# Altium project COMECA.PrjPcb
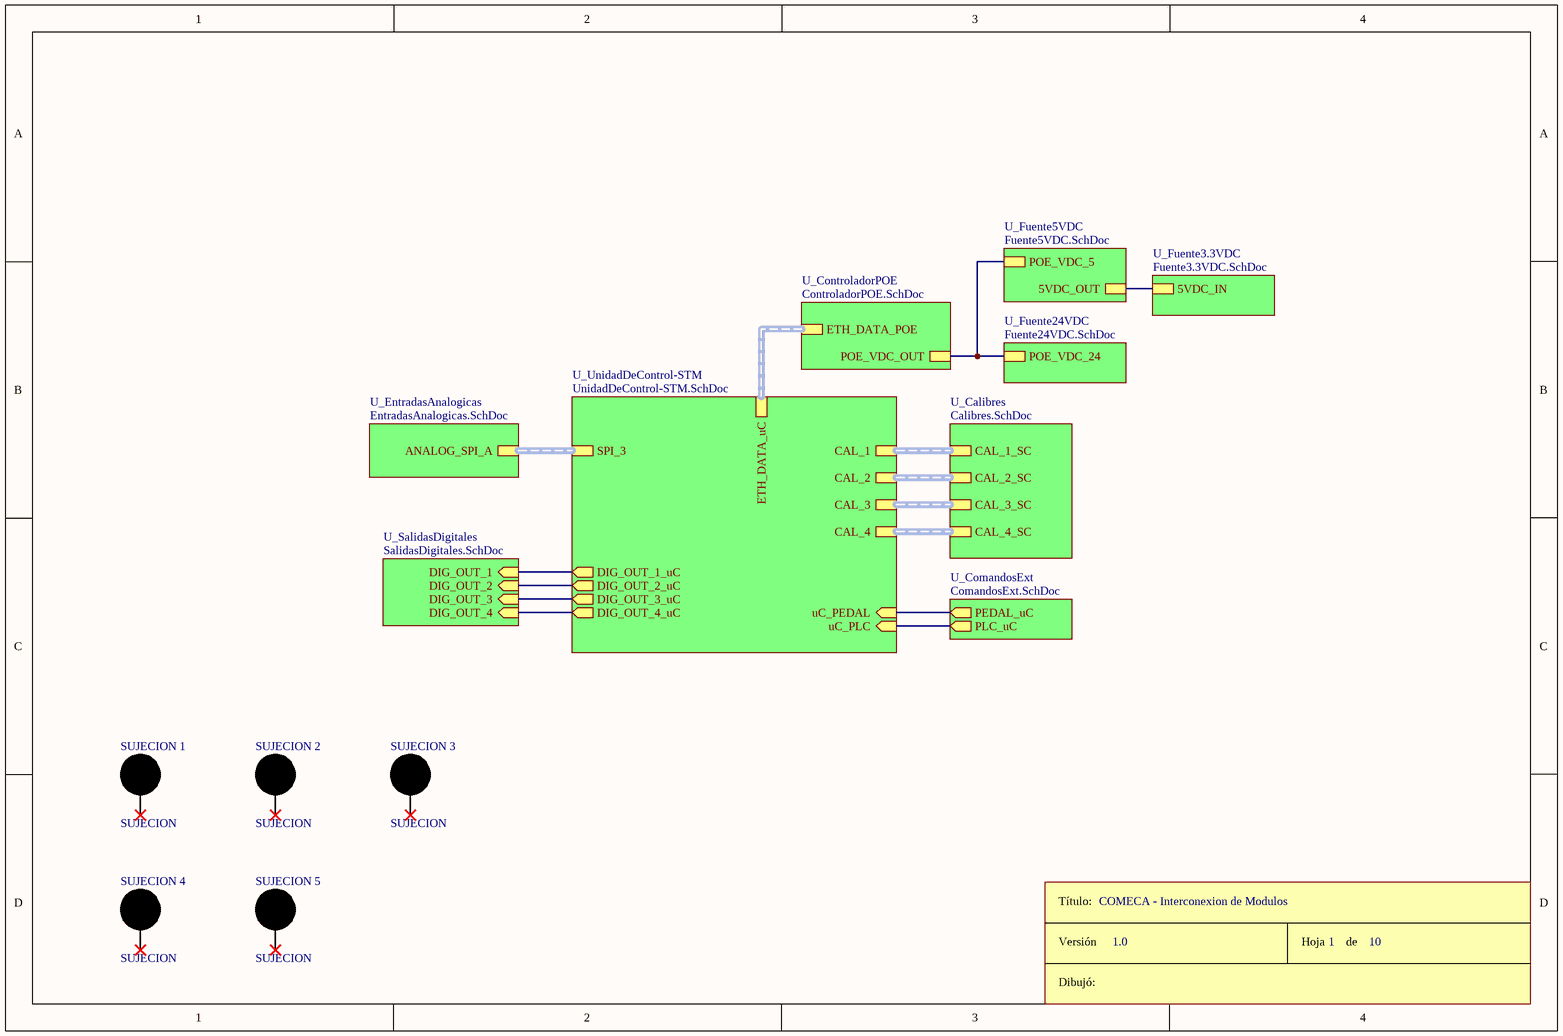
[diagram p0: COMECA_Main.SchDoc]
7 sheets, 101 parts. Net scope: hierarchical (ports join the sheet entries above them; power ports are global).
Board file: COMECA-PCBv1.PcbDoc
Sheets:
  COMECA_Main.SchDoc
    U_ControladorPOE = ControladorPOE.SchDoc
    U_Fuente5VDC = Fuente5VDC.SchDoc
    U_Fuente24VDC = Fuente24VDC.SchDoc
    U_Fuente3.3VDC = Fuente3.3VDC.SchDoc
    U_EntradasAnalogicas = EntradasAnalogicas.SchDoc
    U_SalidasDigitales = SalidasDigitales.SchDoc

## Sheet COMECA_Main.SchDoc
size A4; SheetNumber: 1; SheetTotal: 10

### Parts
ROT9  Rótulo  (value not drawn)  (graphical)
SUJECION_1  SUJECION  [SUJECION (5.00MM - 3.50MM)]
SUJECION_2  SUJECION  [SUJECION (5.00MM - 3.50MM)]
SUJECION_3  SUJECION  [SUJECION (5.00MM - 3.50MM)]
SUJECION_4  SUJECION  [SUJECION (5.00MM - 3.50MM)]
SUJECION_5  SUJECION  [SUJECION (5.00MM - 3.50MM)]

### Sub-sheets
U_Calibres = Calibres.SchDoc (file not in this document): CAL_4_SC (harness CALIBRE), CAL_3_SC (harness CALIBRE), CAL_2_SC (harness CALIBRE), CAL_1_SC (harness CALIBRE)
U_ComandosExt = ComandosExt.SchDoc (file not in this document): PLC_uC (out), PEDAL_uC (out)
U_ControladorPOE = ControladorPOE.SchDoc: POE_VDC_OUT, ETH_DATA_POE (harness ETH_DATA)
U_EntradasAnalogicas = EntradasAnalogicas.SchDoc: ANALOG_SPI_A (harness ANALOG_SPI)
U_Fuente3.3VDC = Fuente3.3VDC.SchDoc: 5VDC_IN
U_Fuente5VDC = Fuente5VDC.SchDoc: POE_VDC_5, 5VDC_OUT
U_Fuente24VDC = Fuente24VDC.SchDoc: POE_VDC_24
U_SalidasDigitales = SalidasDigitales.SchDoc: DIG_OUT_4 (in), DIG_OUT_2 (in), DIG_OUT_3 (in), DIG_OUT_1 (in)
U_UnidadDeControl-STM = UnidadDeControl-STM.SchDoc (file not in this document): uC_PLC (in), uC_PEDAL (in), SPI_3 (harness ANALOG_SPI), CAL_2 (harness CALIBRE), CAL_3 (harness CALIBRE), CAL_4 (harness CALIBRE), CAL_1 (harness CALIBRE), DIG_OUT_3_uC (out), DIG_OUT_2_uC (out), DIG_OUT_1_uC (out), DIG_OUT_4_uC (out), ETH_DATA_uC (harness ETH_DATA)

### Nets
5VDC_OUT: sheet U_Fuente5VDC/5VDC_OUT, sheet U_Fuente3.3VDC/5VDC_IN
VDD: sheet U_ControladorPOE/POE_VDC_OUT, sheet U_Fuente5VDC/POE_VDC_5, sheet U_Fuente24VDC/POE_VDC_24
NetR13_1: sheet U_UnidadDeControl-STM/DIG_OUT_1_uC, sheet U_SalidasDigitales/DIG_OUT_1
NetR16_1: sheet U_UnidadDeControl-STM/DIG_OUT_2_uC, sheet U_SalidasDigitales/DIG_OUT_2
NetR19_1: sheet U_UnidadDeControl-STM/DIG_OUT_3_uC, sheet U_SalidasDigitales/DIG_OUT_3
NetR22_1: sheet U_UnidadDeControl-STM/DIG_OUT_4_uC, sheet U_SalidasDigitales/DIG_OUT_4
(unnamed): sheet U_ComandosExt/PLC_uC, sheet U_UnidadDeControl-STM/uC_PLC
(unnamed): sheet U_ComandosExt/PEDAL_uC, sheet U_UnidadDeControl-STM/uC_PEDAL

Not connected (* = marked no-connect by the designer): SUJECION_1 1*; SUJECION_2 1*; SUJECION_3 1*; SUJECION_4 1*; SUJECION_5 1*

### Buses and harness runs
harness sheet U_Calibres/CAL_1_SC = sheet U_UnidadDeControl-STM/CAL_1
harness sheet U_Calibres/CAL_2_SC = sheet U_UnidadDeControl-STM/CAL_2
harness sheet U_Calibres/CAL_3_SC = sheet U_UnidadDeControl-STM/CAL_3
harness sheet U_Calibres/CAL_4_SC = sheet U_UnidadDeControl-STM/CAL_4
harness sheet U_ControladorPOE/ETH_DATA_POE = sheet U_UnidadDeControl-STM/ETH_DATA_uC
harness sheet U_EntradasAnalogicas/ANALOG_SPI_A = sheet U_UnidadDeControl-STM/SPI_3

### Notes on the sheet
- COMECA - Interconexion de Modulos
- 1.0
- 1
- 10
- (in symbol Rótulo) Título:; Versión; Hoja       de; Dibujó:

## Sheet ControladorPOE.SchDoc
size A4; SheetNumber: 8; SheetTotal: 10
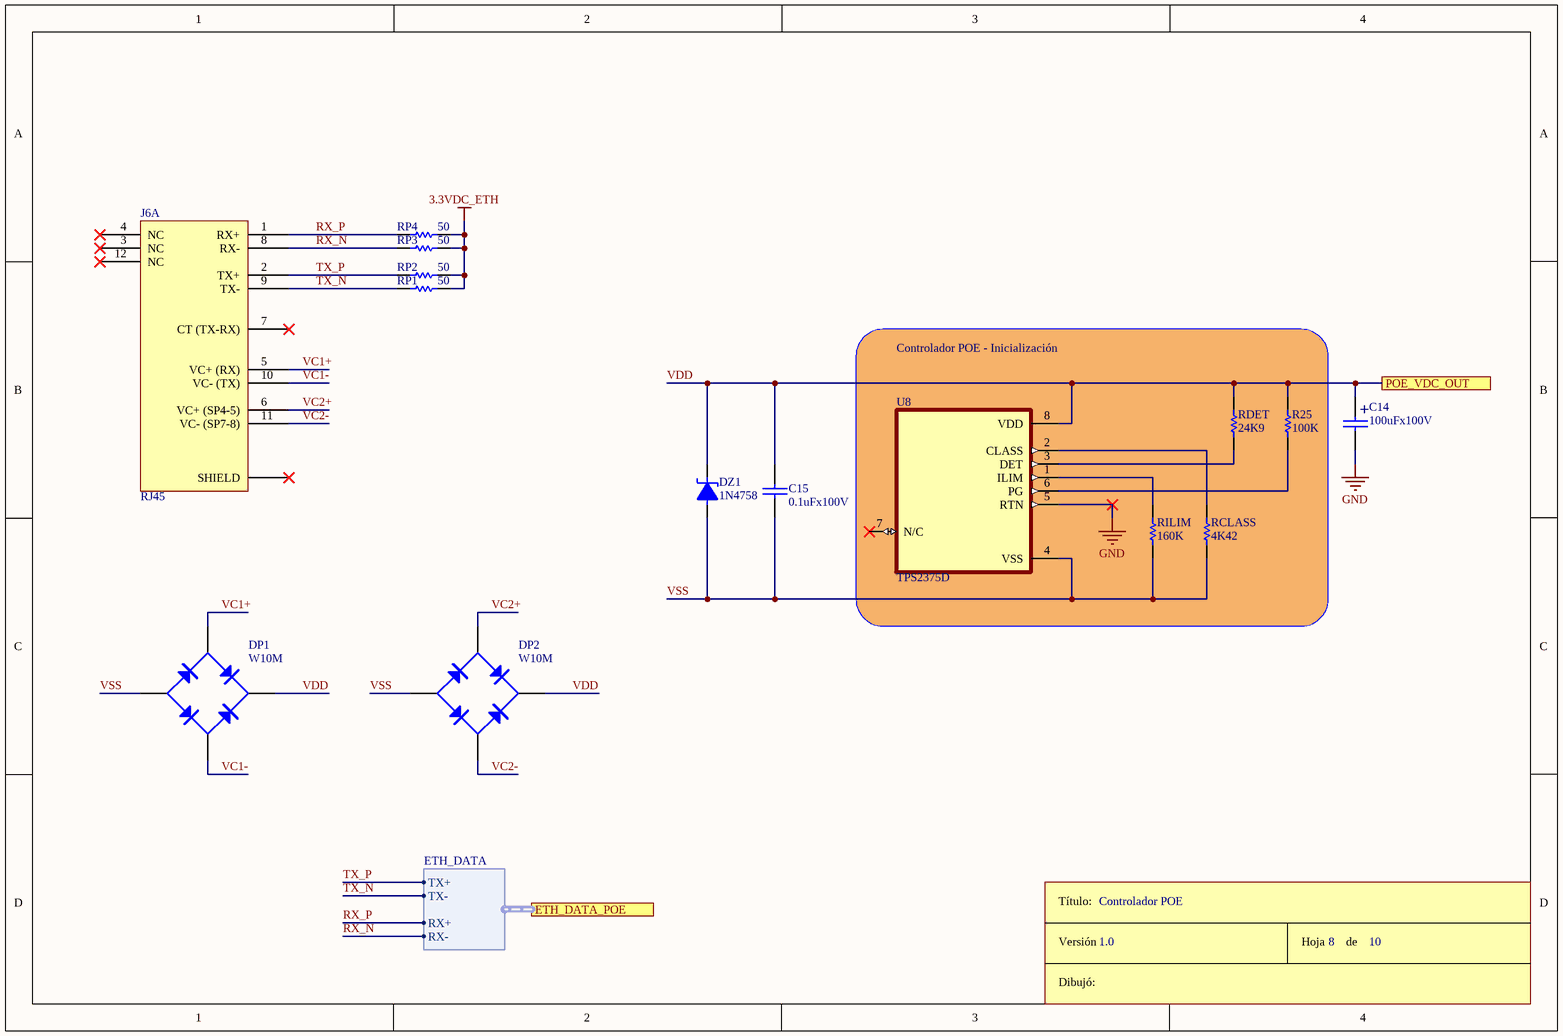
[diagram p1: ControladorPOE.SchDoc]

### Parts
C14  100uFx100V  [CAP200RP]
C15  0.1uFx100V  [CAP300]
DP1  W10M  [PUENTE - W10M]
DP2  W10M  [PUENTE - W10M]
DZ1  1N4758  [DO41]
J6A  RJ45  [ARJP11C-MB]
R25  100K  [RES300]
RCLASS  4K42  [RES300]
RDET  24K9  [RES300]
RILIM  160K  [RES300]
ROT7  Rótulo  (value not drawn)  (graphical)
RP1  50  [1206]
RP2  50  [1206]
RP3  50  [1206]
RP4  50  [1206]
U8  TPS2375D  [SOIC127P599X175-8N]

### Blocks framed on the sheet
Controlador POE - Inicialización: R25 RCLASS RDET RILIM U8

### Ports
ETH_DATA_POE (harness ETH_DATA), POE_VDC_OUT

### Harnesses
ETH_DATA: TX+, TX-, RX+, RX-

### Nets
3.3VDC_ETH: RP1.2 RP2.2 RP3.2 RP4.2
GND: C14.2 U8.5(RTN)  [project net ANALOG_GND_A]
RX_N: J6A.8(RX-) RP3.1 ; port ETH_DATA_POE.RX-
RX_P: J6A.1(RX+) RP4.1 ; port ETH_DATA_POE.RX+
TX_N: J6A.9(TX-) RP1.1 ; port ETH_DATA_POE.TX-
TX_P: J6A.2(TX+) RP2.1 ; port ETH_DATA_POE.TX+
VC1+: DP1.2(AC) J6A.5(VC+_(RX))
VC1-: DP1.4(AC) J6A.10(VC-_(TX))
VC2+: DP2.2(AC) J6A.6(VC+_(SP4-5))
VC2-: DP2.4(AC) J6A.11(VC-_(SP7-8))
VDD: C14.1 C15.1 DP1.1(V+) DP2.1(V+) DZ1.2 R25.2 RDET.2 U8.8(VDD) ; port POE_VDC_OUT
VSS: C15.2 DP1.3(V-) DP2.3(V-) DZ1.1 RCLASS.1 RILIM.1 U8.4(VSS)
NetR25_1: R25.1 U8.6(PG)
NetRCLASS_2: RCLASS.2 U8.2(CLASS)
NetRDET_1: RDET.1 U8.3(DET)
NetRILIM_2: RILIM.2 U8.1(ILIM)

Not connected (* = marked no-connect by the designer): J6A 3(NC)* 4(NC)* 7(CT_(TX-RX))* 12(NC)* SHIELD*; U8 7(N/C)*

### Notes on the sheet
- Controlador POE
- 1.0
- 8
- 10
- (in symbol CAPPOL) +
- (in symbol Rótulo) Título:; Versión; Hoja       de; Dibujó:

### Library data of the parts
C14 = CAPPOL
C15 = CAP
DP1 DP2 = W10M: Bridge Rectifier TH 1000V 1.5A
DZ1 = DIODO ZENER
J6A = ARJP11C-MBSC-L2: Magjack Connector for PoE
R25 RCLASS RDET RILIM RP1-RP4 = RES
U8 = TPS2375D: Class 3 PoE PD with latch protection 8-SOIC -40 to 85; MF: Texas Instruments; Purchase-URL: https://pricing.snapeda.com/search/part/TPS2375D/?ref=eda; MP: TPS2375D; Package: SOIC-8 Texas Instruments; SnapEDA_Link: https://www.snapeda.com/parts/TPS2375D/Texas%20Instruments/view-part/570877/?ref=snap; Value: *; Check_prices: https://www.snapeda.com/parts/TPS2375D/Texas%20Instruments/view-part/570877/?ref=eda; Digi-Key_Part_Number: 296-26922-2-ND

## Sheet Fuente5VDC.SchDoc
size A4; SheetNumber: 3; SheetTotal: 10
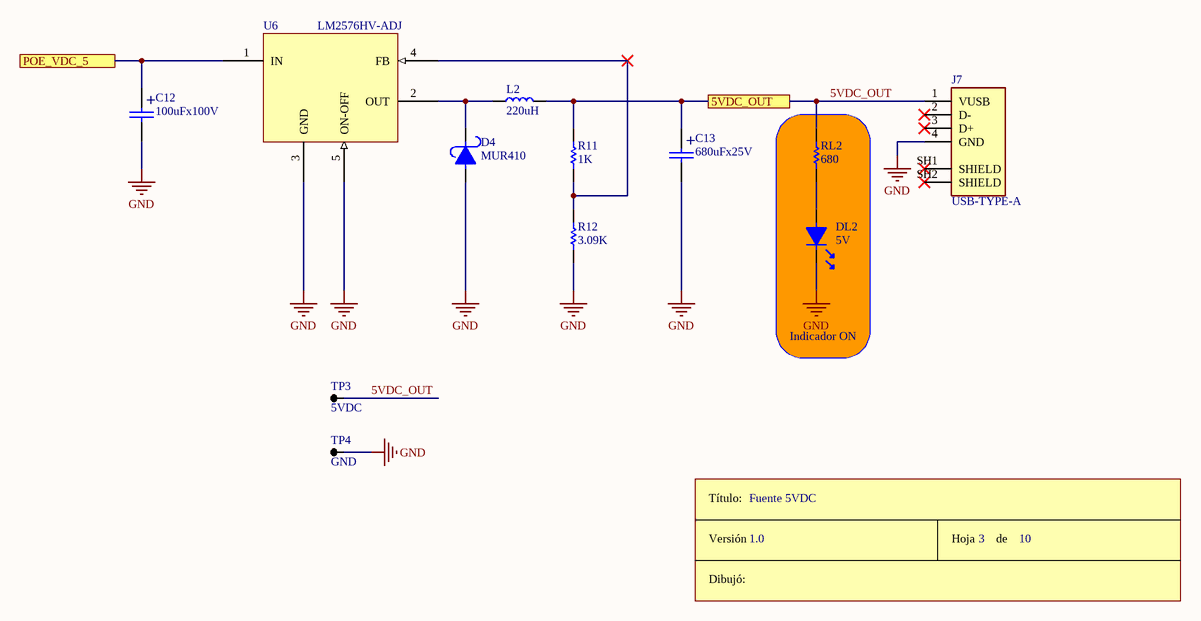
[diagram p2: Fuente5VDC.SchDoc]

### Parts
C12  100uFx100V  [CAP200RP]
C13  680uFx25V  [CAP200RP]
D4  MUR410  [DO41-EXT]
DL2  5V  [LED3]
J7  USB-TYPE-A  [TE_6364372-2]
L2  220uH  [CHOKE_PAD]
R11  1K  [RES300]
R12  3.09K  [RES300]
RL2  680  [RES300]
ROT5  Rótulo  (value not drawn)  (graphical)
TP3  5VDC  [TPTH]
TP4  GND  [TPTH]
U6  LM2576HV-ADJ  [TO220-5]

### Blocks framed on the sheet
Indicador ON: DL2 RL2

### Ports
5VDC_OUT, POE_VDC_5

### Nets
GND: C12.2 C13.2 D4.1 DL2.2 J7.4(GND) R12.1 TP4.1 U6.3(GND) U6.5(ON-OFF)  [project net ANALOG_GND_A]
5VDC_OUT: C13.1 J7.1(VUSB) L2.2 R11.2 RL2.2 TP3.1 ; port 5VDC_OUT
VDD: C12.1 U6.1(IN) ; port POE_VDC_5
NetD4_2: D4.2 L2.1 U6.2(OUT)
NetDL2_1: DL2.1 RL2.1
NetR11_1: R11.1 R12.2 U6.4(FB)

Not connected (* = marked no-connect by the designer): J7 2(D-)* 3(D+)* SH1(SHIELD)* SH2(SHIELD)*

### Notes on the sheet
- Fuente 5VDC
- 1.0
- 3
- 10
- (in symbol CAPPOL) +
- (in symbol Rótulo) Título:; Versión; Hoja       de; Dibujó:

### Library data of the parts
C12 C13 = CAPPOL
D4 = DIODO SCHOTTKY
DL2 = LED
J7 = 6364372-2: Conn USB 2.0 Type A RCP 4 POS Solder RA Thru-Hole 4 Terminal 1 Port Box/Tube; MF: TE Connectivity; Digi-Key_Purchase_URL: https://www.digikey.com/product-detail/en/te-connectivity-amp-connectors/6364372-2/A122647-ND/2286712?utm_source=snapeda&utm_medium=aggregator&utm_campaign=symbol; SnapEDA_Link: https://www.snapeda.com/parts/6364372-2/TE%20Connectivity%20AMP%20Connectors/view-part/2053020/?ref=snap; EU_RoHS_Compliance: Compliant; MP: 6364372-2; Value: *; TE_purchase_URL: https://www.te.com/usa-en/product-6364372-2.html?te_bu=Cor&te_type=disp&te_campaign=seda_glo_cor-seda-global-disp-prtnr-fy19-seda-model-bom-cta_sma-317_1&elqCampaignId=32493; Digi-Key_Part_Number: A122647-ND; Package: None
L2 = Choke
R11 R12 RL2 = RES
TP3 TP4 = TP
U6 = LM257X: Buck Switching Regulator IC Positive Output 1A TO-220-5 Formed Leads

## Sheet Fuente24VDC.SchDoc
size A4; SheetNumber: 2; SheetTotal: 10
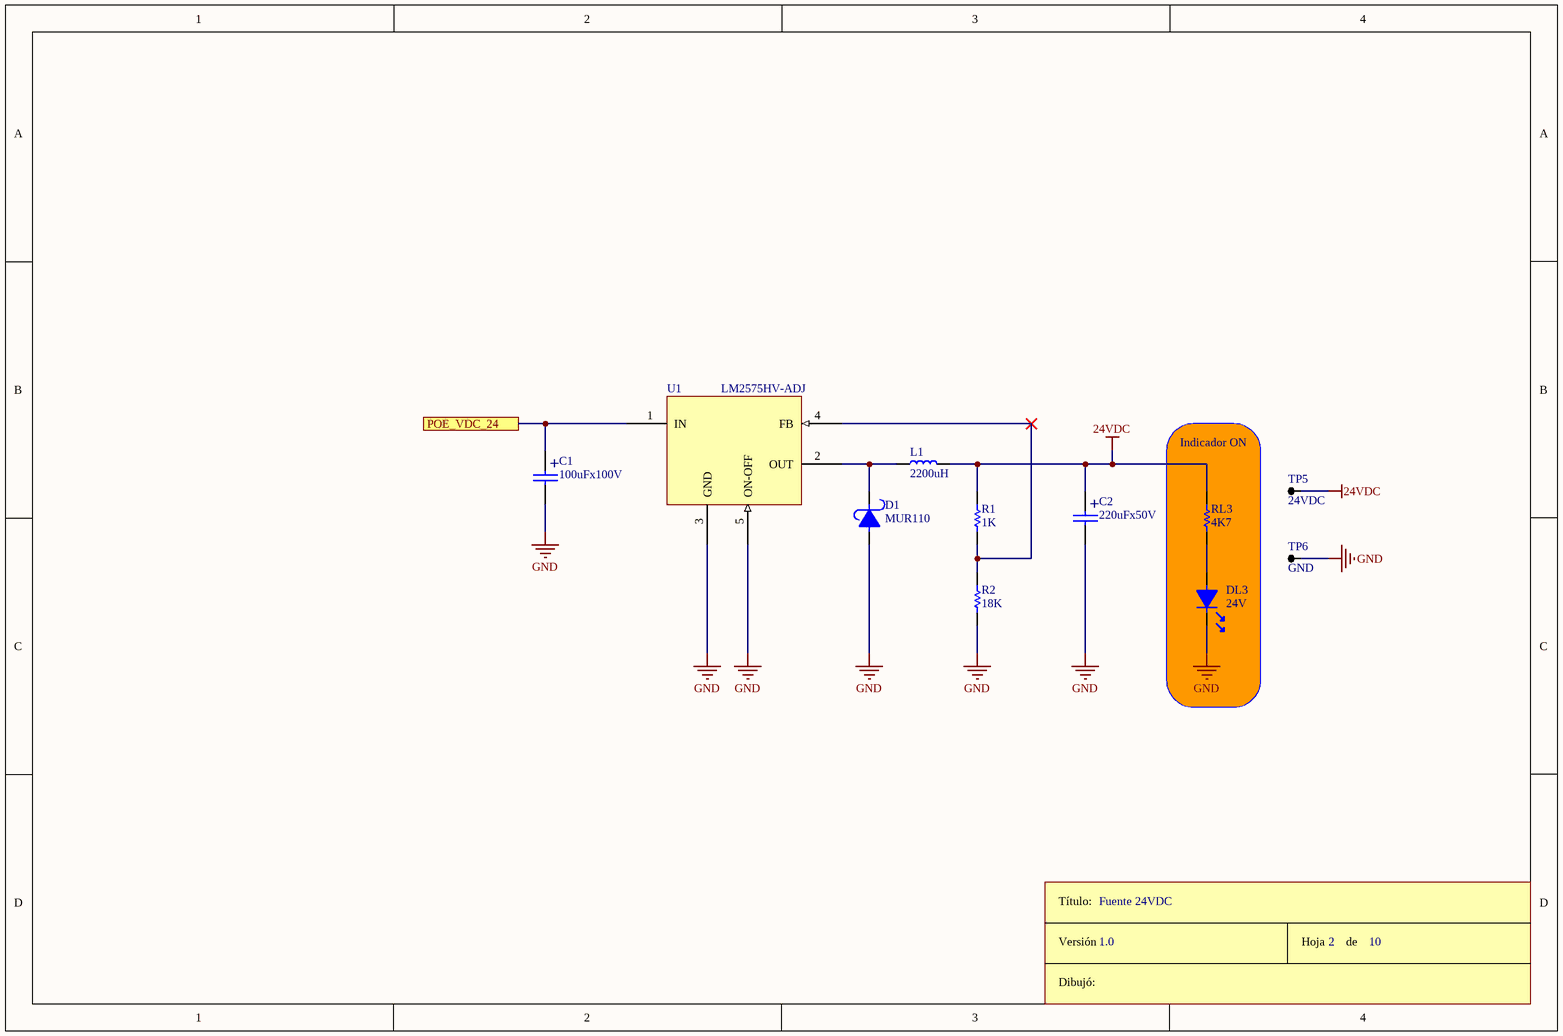
[diagram p3: Fuente24VDC.SchDoc]

### Parts
C1  100uFx100V  [CAP200RP]
C2  220uFx50V  [CAP200RP]
D1  MUR110  [DO41]
DL3  24V  [LED3]
L1  2200uH  [Choke10.5]
R1  1K  [RES300]
R2  18K  [RES300]
RL3  4K7  [RES300]
ROT1  Rótulo  (value not drawn)  (graphical)
TP5  24VDC  [TPTH]
TP6  GND  [TPTH]
U1  LM2575HV-ADJ  [TO220-5]

### Blocks framed on the sheet
Indicador ON: DL3 RL3

### Ports
POE_VDC_24

### Nets
24VDC: C2.1 L1.2 R1.2 RL3.2 TP5.1
GND: C1.2 C2.2 D1.1 DL3.2 R2.1 TP6.1 U1.3(GND) U1.5(ON-OFF)  [project net ANALOG_GND_A]
VDD: C1.1 U1.1(IN) ; port POE_VDC_24
NetD1_2: D1.2 L1.1 U1.2(OUT)
NetDL3_1: DL3.1 RL3.1
NetR1_1: R1.1 R2.2 U1.4(FB)

### Notes on the sheet
- Fuente 24VDC
- 1.0
- 2
- 10
- (in symbol CAPPOL) +
- (in symbol Rótulo) Título:; Versión; Hoja       de; Dibujó:

### Library data of the parts
C1 C2 = CAPPOL
D1 = DIODO SCHOTTKY
DL3 = LED
L1 = Choke
R1 R2 RL3 = RES
TP5 TP6 = TP
U1 = LM257X: as U6 on sheet Fuente5VDC

## Sheet Fuente3.3VDC.SchDoc
size A4; SheetNumber: 4; SheetTotal: 10
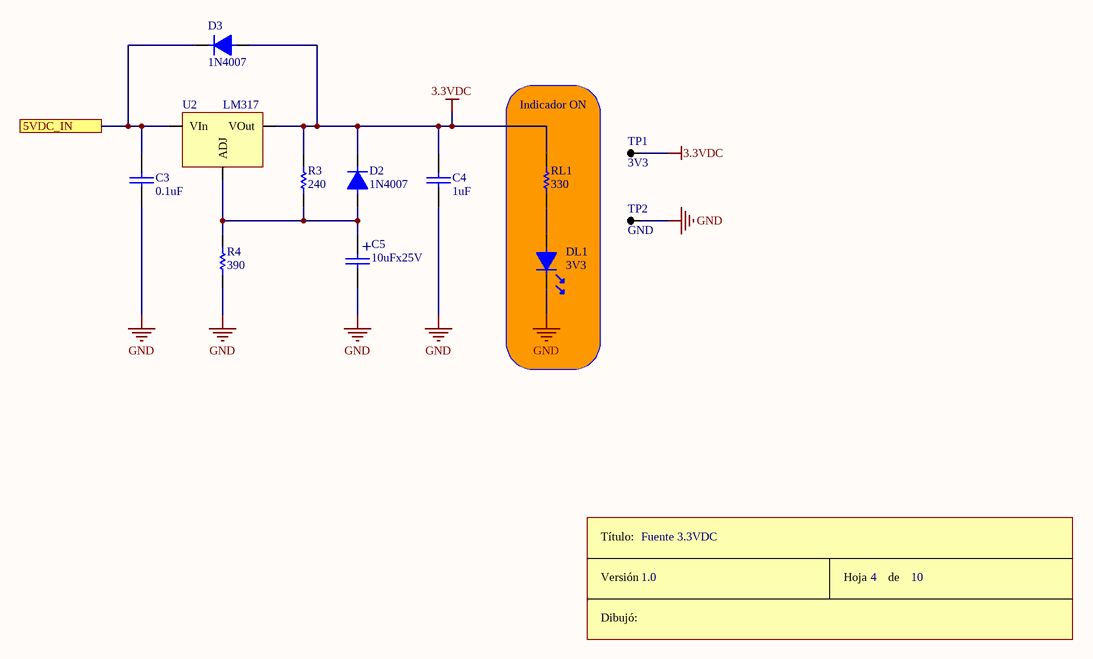
[diagram p4: Fuente3.3VDC.SchDoc]

### Parts
C3  0.1uF  [CAP100]
C4  1uF  [CAP200]
C5  10uFx25V  [CAP100RP]
D2  1N4007  [DO41]
D3  1N4007  [DO41]
DL1  3V3  [LED3]
R3  240  [RES400]
R4  390  [RES400]
RL1  330  [RES300]
ROT2  Rótulo  (value not drawn)  (graphical)
TP1  3V3  [TPTH]
TP2  GND  [TPTH]
U2  LM317  [TO-220 H]

### Blocks framed on the sheet
Indicador ON: DL1 RL1

### Ports
5VDC_IN

### Nets
3.3VDC: C4.1 D2.2 D3.1 R3.2 RL1.2 TP1.1 U2.2(VOut)
GND: C3.2 C4.2 C5.2 DL1.2 R4.1 TP2.1  [project net ANALOG_GND_A]
5VDC_OUT: C3.1 D3.2 U2.3(VIn) ; port 5VDC_IN
NetC5_1: C5.1 D2.1 R3.1 R4.2 U2.1(ADJ)
NetDL1_1: DL1.1 RL1.1

### Notes on the sheet
- Fuente 3.3VDC
- 1.0
- 4
- 10
- (in symbol CAPPOL) +
- (in symbol Rótulo) Título:; Versión; Hoja       de; Dibujó:

### Library data of the parts
C3 C4 = CAP
C5 = CAPPOL
D2 D3 = DIODO
DL1 = LED
R3 R4 RL1 = RES
TP1 TP2 = TP
U2 = LM317: IC REG ADJ 1.5A 3 TERM TO-220

## Sheet EntradasAnalogicas.SchDoc
size A4; SheetNumber: 6; SheetTotal: 10
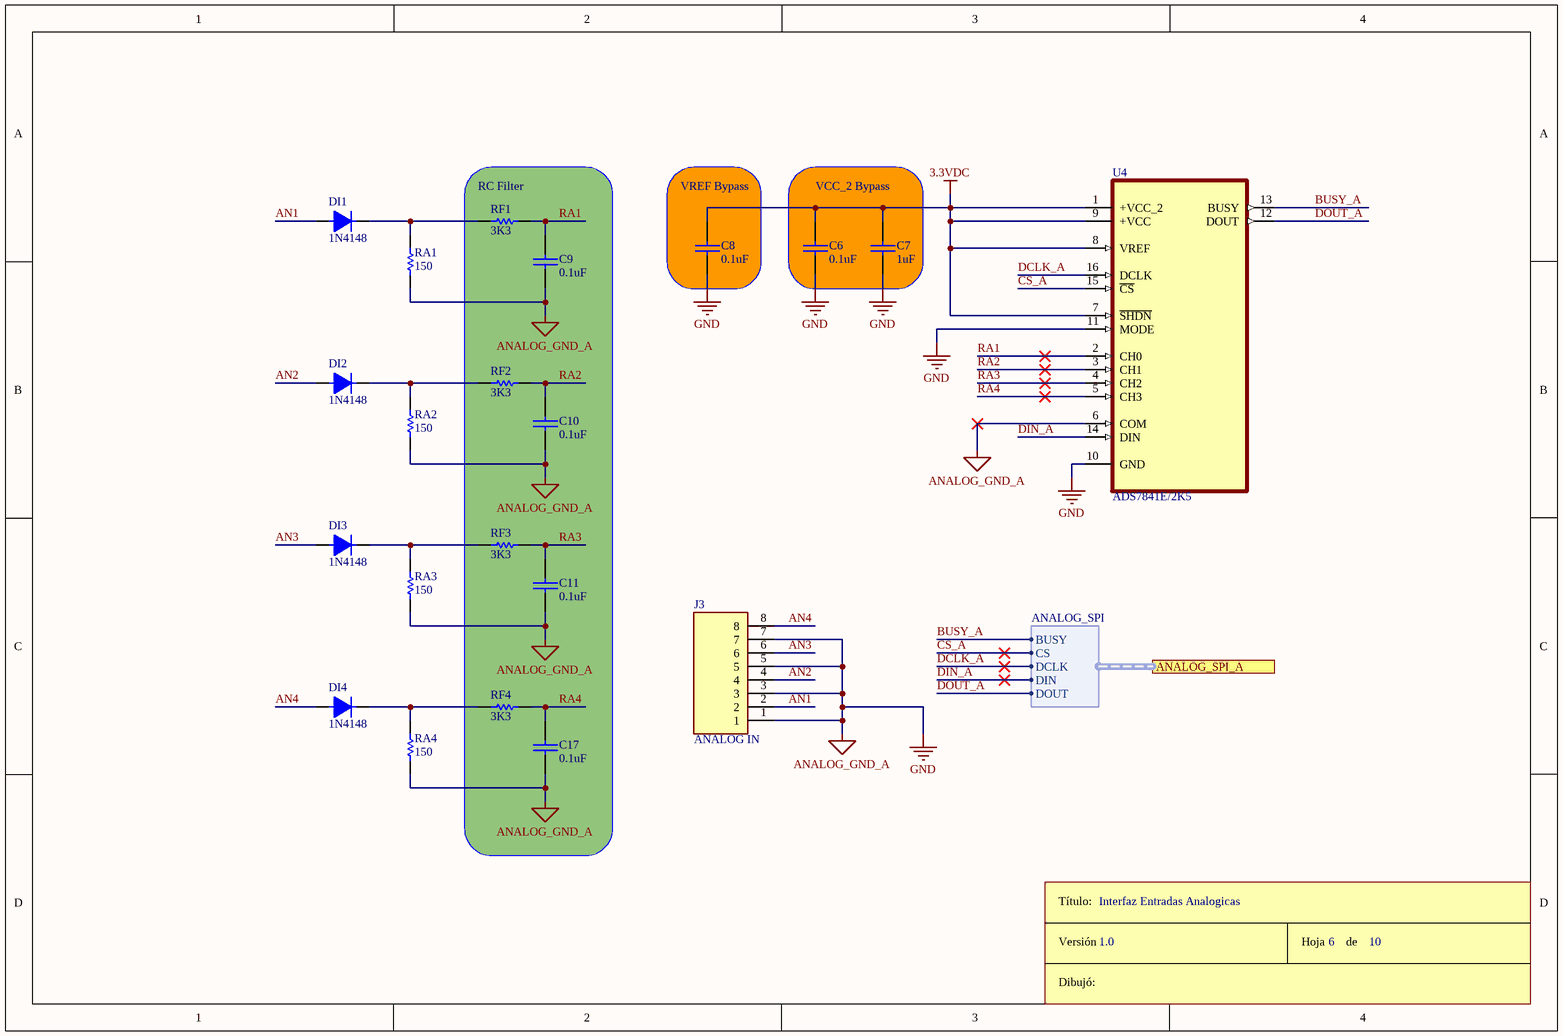
[diagram p5: EntradasAnalogicas.SchDoc]

### Parts
C6  0.1uF  [CAP100]
C7  1uF  [CAP200]
C8  0.1uF  [CAP100]
C9  0.1uF  [CAP100]
C10  0.1uF  [CAP100]
C11  0.1uF  [CAP100]
C17  0.1uF  [CAP100]
DI1  1N4148  [DO41]
DI2  1N4148  [DO41]
DI3  1N4148  [DO41]
DI4  1N4148  [DO41]
J3  ANALOG IN  [TE_1586863-8]
RA1  150  [RES300]
RA2  150  [RES300]
RA3  150  [RES300]
RA4  150  [RES300]
RF1  3K3  [RES300]
RF2  3K3  [RES300]
RF3  3K3  [RES300]
RF4  3K3  [RES300]
ROT4  Rótulo  (value not drawn)  (graphical)
U4  ADS7841E/2K5  [SOP63P600X175-16N]

### Blocks framed on the sheet
RC Filter: C9-C11 C17 RF1-RF4
VREF Bypass: C8
VCC_2 Bypass: C6 C7

### Ports
ANALOG_SPI_A (harness ANALOG_SPI)

### Harnesses
ANALOG_SPI: BUSY, CS, DCLK, DIN, DOUT

### Nets
3.3VDC: C6.1 C7.1 C8.1 U4.1(+VCC_2) U4.7(~{SHDN}) U4.8(VREF) U4.9(+VCC)
ANALOG_GND_A: C6.2 C7.2 C8.2 C9.2 C10.2 C11.2 C17.2 J3.1 J3.3 J3.5 J3.7 RA1.1 RA2.1 RA3.1 RA4.1 U4.6(COM) U4.10(GND) U4.11(MODE)  [also labelled GND]
AN1: DI1.1 J3.2
AN2: DI2.1 J3.4
AN3: DI3.1 J3.6
AN4: DI4.1 J3.8
BUSY_A: U4.13(BUSY) ; port ANALOG_SPI_A.BUSY
CS_A: U4.15(~{CS}) ; port ANALOG_SPI_A.CS
DCLK_A: U4.16(DCLK) ; port ANALOG_SPI_A.DCLK
DIN_A: U4.14(DIN) ; port ANALOG_SPI_A.DIN
DOUT_A: U4.12(DOUT) ; port ANALOG_SPI_A.DOUT
RA1: C9.1 RF1.2 U4.2(CH0)
RA2: C10.1 RF2.2 U4.3(CH1)
RA3: C11.1 RF3.2 U4.4(CH2)
RA4: C17.1 RF4.2 U4.5(CH3)
NetDI1_2: DI1.2 RA1.2 RF1.1
NetDI2_2: DI2.2 RA2.2 RF2.1
NetDI3_2: DI3.2 RA3.2 RF3.1
NetDI4_2: DI4.2 RA4.2 RF4.1

### Notes on the sheet
- Interfaz Entradas Analogicas
- 1.0
- 6
- 10
- (in symbol Rótulo) Título:; Versión; Hoja       de; Dibujó:

### Library data of the parts
C6-C11 C17 = CAP
DI1-DI4 = DIODO
J3 = 1586863-8: Conn Power HDR 8 POS 4.2mm Solder RA Thru-Hole 8 Terminal 1 Port Tray; MF: TE Connectivity; EU_RoHS_Compliance: Compliant; SnapEDA_Link: https://www.snapeda.com/parts/1586863-8/TE%20Connectivity%20AMP%20Connectors/view-part/1404500/?ref=snap; Price: None; Package: None; Availability: Unavailable; MP: 1586863-8; TE_purchase_URL: https://www.te.com/usa-en/product-1586863-8.html?te_bu=Cor&te_type=disp&te_campaign=seda_glo_cor-seda-global-disp-prtnr-fy19-seda-model-bom-cta_sma-317_1&elqCampaignId=32493; Value: *
RA1-RA4 RF1-RF4 = RES
U4 = ADS7841E/2K5: ANALOG-TO-DIGITAL CONVERTER; Package: None; Price: None; Value: *; MP: ADS7841E/2K5; Availability: Unavailable

## Sheet SalidasDigitales.SchDoc
size A4; SheetNumber: 7; SheetTotal: 10
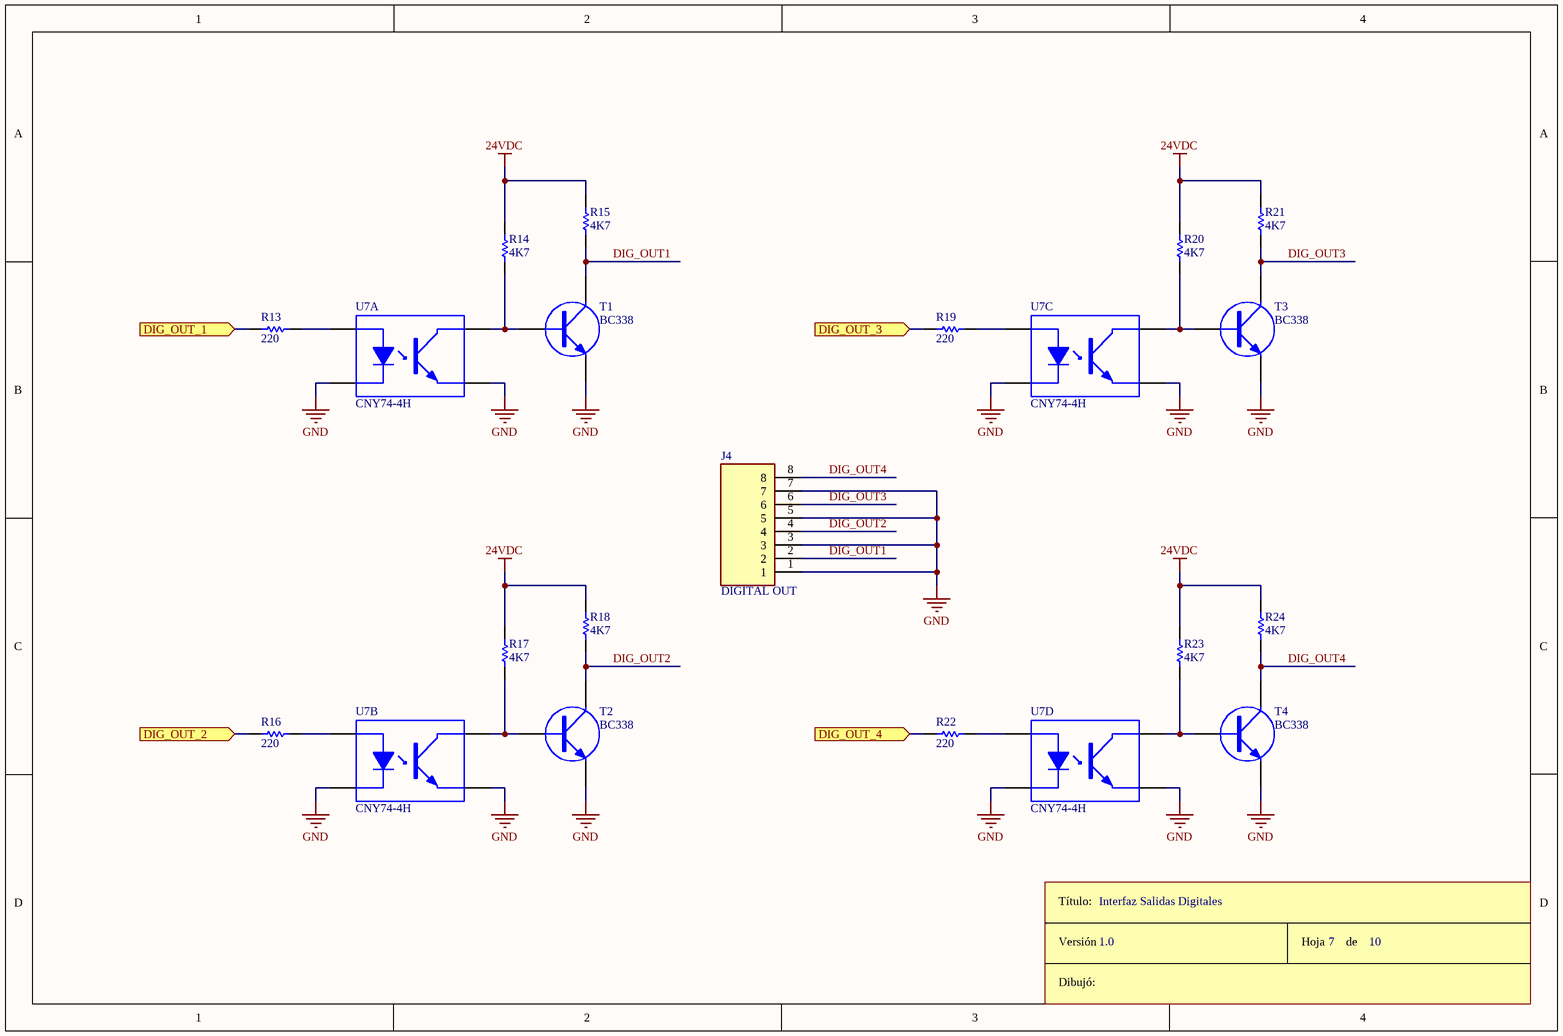
[diagram p6: SalidasDigitales.SchDoc]

### Parts
J4  DIGITAL OUT  [TE_1586863-8]
R13  220  [RES400]
R14  4K7  [RES400]
R15  4K7  [RES400]
R16  220  [RES400]
R17  4K7  [RES400]
R18  4K7  [RES400]
R19  220  [RES400]
R20  4K7  [RES400]
R21  4K7  [RES400]
R22  220  [RES400]
R23  4K7  [RES400]
R24  4K7  [RES400]
ROT6  Rótulo  (value not drawn)  (graphical)
T1  BC338  [TO92]
T2  BC338  [TO92]
T3  BC338  [TO92]
T4  BC338  [TO92]
U7  CNY74-4H  [DIP16]  (parts A,B,C,D of 4)

### Ports
DIG_OUT_1 (in), DIG_OUT_2 (in), DIG_OUT_3 (in), DIG_OUT_4 (in)

### Nets
24VDC: R14.2 R15.2 R17.2 R18.2 R20.2 R21.2 R23.2 R24.2
GND: J4.1 J4.3 J4.5 J4.7 T1.3(E) T2.3(E) T3.3(E) T4.3(E) U7.2(K) U7.3(K) U7.6(K) U7.7(K) U7.9(E) U7.12(E) U7.13(E) U7.16(E)  [project net ANALOG_GND_A]
DIG_OUT1: J4.2 R15.1 T1.2(C)
DIG_OUT2: J4.4 R18.1 T2.2(C)
DIG_OUT3: J4.6 R21.1 T3.2(C)
DIG_OUT4: J4.8 R24.1 T4.2(C)
NetR13_1: R13.1 ; port DIG_OUT_1
NetR13_2: R13.2 U7.1(A)
NetR14_1: R14.1 T1.1(B) U7.15(C)
NetR16_1: R16.1 ; port DIG_OUT_2
NetR16_2: R16.2 U7.4(A)
NetR17_1: R17.1 T2.1(B) U7.14(C)
NetR19_1: R19.1 ; port DIG_OUT_3
NetR19_2: R19.2 U7.5(A)
NetR20_1: R20.1 T3.1(B) U7.11(C)
NetR22_1: R22.1 ; port DIG_OUT_4
NetR22_2: R22.2 U7.8(A)
NetR23_1: R23.1 T4.1(B) U7.10(C)

### Notes on the sheet
- Interfaz Salidas Digitales
- 1.0
- 7
- 10
- (in symbol Rótulo) Título:; Versión; Hoja       de; Dibujó:

### Library data of the parts
J4 = 1586863-8: as J3 on sheet EntradasAnalogicas; EU_RoHS_Compliance: Compliant; SnapEDA_Link: https://www.snapeda.com/parts/1586863-8/TE%20Connectivity%20AMP%20Connectors/view-part/1404500/?ref=snap; Price: None; Package: None; Availability: Unavailable; MP: 1586863-8; TE_purchase_URL: https://www.te.com/usa-en/product-1586863-8.html?te_bu=Cor&te_type=disp&te_campaign=seda_glo_cor-seda-global-disp-prtnr-fy19-seda-model-bom-cta_sma-317_1&elqCampaignId=32493; Value: *
R13-R24 = RES
T1-T4 = TRANSISTOR NPN

## Nets that join several sheets
3.3VDC: Fuente3.3VDC (7 pins), EntradasAnalogicas (7 pins)
24VDC: Fuente24VDC (5 pins), SalidasDigitales (8 pins)
ANALOG_GND_A: ControladorPOE (C14.2 U8.5), Fuente5VDC (9 pins), Fuente24VDC (8 pins), Fuente3.3VDC (6 pins), EntradasAnalogicas (18 pins), SalidasDigitales (16 pins)
5VDC_OUT: Fuente5VDC (6 pins), Fuente3.3VDC (C3.1 D3.2 U2.3)
VDD: ControladorPOE (8 pins), Fuente5VDC (C12.1 U6.1), Fuente24VDC (C1.1 U1.1)